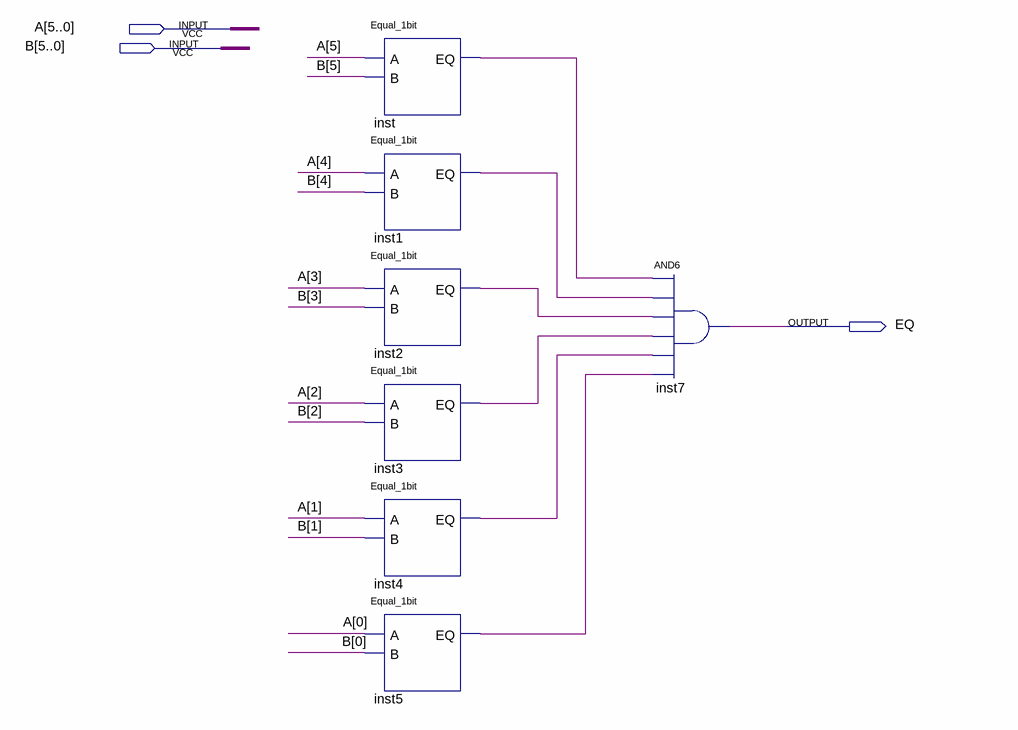
[diagram p0: schematic sheet]
// Quartus schematic Equal_5bits.bdf as structural Verilog: 7 symbols, 3 pins
module Equal_5bits (
  input  [5:0] A,
  input  [5:0] B,
  output EQ
);

  wire inst1_eq, inst2_eq, inst3_eq, inst4_eq, inst5_eq, inst_eq;

  Equal_1bit inst (.A(A[5]), .B(B[5]), .EQ(inst_eq));
  Equal_1bit inst1 (.A(A[4]), .B(B[4]), .EQ(inst1_eq));
  Equal_1bit inst2 (.A(A[3]), .B(B[3]), .EQ(inst2_eq));
  Equal_1bit inst3 (.A(A[2]), .B(B[2]), .EQ(inst3_eq));
  Equal_1bit inst4 (.A(A[1]), .B(B[1]), .EQ(inst4_eq));
  Equal_1bit inst5 (.A(A[0]), .B(B[0]), .EQ(inst5_eq));
  and inst7 (EQ, inst_eq, inst1_eq, inst2_eq, inst3_eq, inst4_eq, inst5_eq);
endmodule
